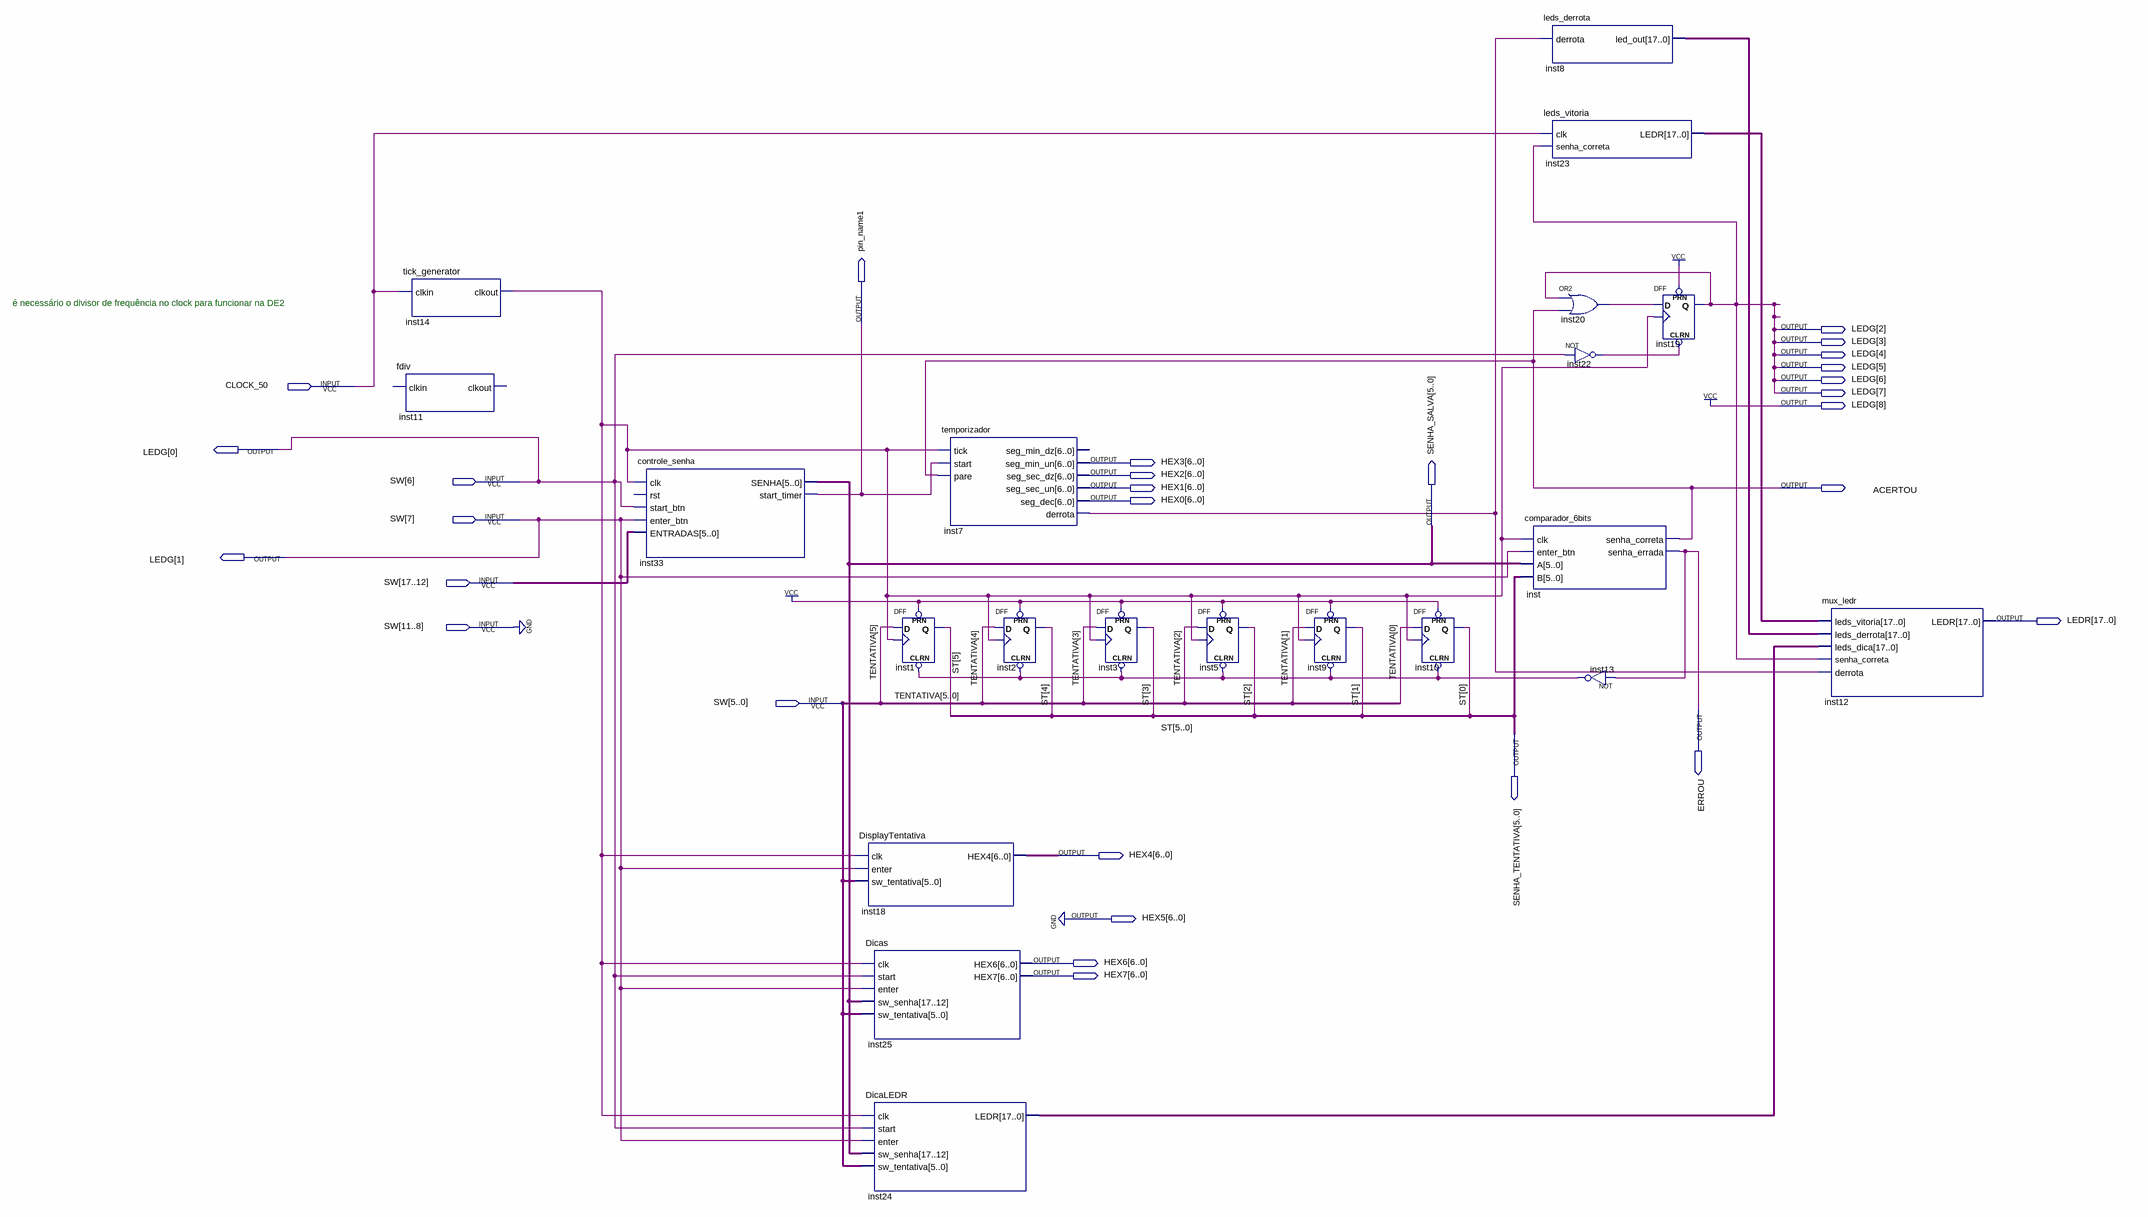
[diagram p0: schematic sheet]
// Quartus schematic bomba_relogio.bdf as structural Verilog: 21 symbols, 29 pins
module bomba_relogio (
  input  CLOCK_50,
  input  [17:0] SW,
  output pin_name1,
  output [8:0] LEDG,
  output [6:0] HEX3,
  output [6:0] HEX2,
  output [6:0] HEX1,
  output ACERTOU,
  output [6:0] HEX0,
  output [5:0] SENHA_SALVA,
  output [17:0] LEDR,
  output ERROU,
  output [5:0] SENHA_TENTATIVA,
  output [6:0] HEX4,
  output [6:0] HEX5,
  output [6:0] HEX6,
  output [6:0] HEX7
);

  wire inst7_derrota, inst13_out, inst14_clkout, inst20_out, inst22_out;
  wire [17:0] inst8_led_out, inst23_ledr, inst24_ledr;

  fdiv inst11 ();  // open: clkin, clkout
  tick_generator inst14 (.clkin(CLOCK_50), .clkout(inst14_clkout));
  controle_senha inst33 (
    .clk(inst14_clkout), .start_btn(SW[6]), .enter_btn(SW[7]), .ENTRADAS(SW[17:12]), .SENHA(SENHA_SALVA),
    .start_timer(pin_name1));  // open: rst
  DFF inst1 (.CLRN(inst13_out), .CLK(inst14_clkout), .D(SW[5]), .PRN(1'b1), .Q(SENHA_TENTATIVA[5]));
  DisplayTentativa inst18 (.clk(inst14_clkout), .enter(SW[7]), .sw_tentativa(SW[5:0]), .HEX4(HEX4));
  Dicas inst25 (
    .clk(inst14_clkout), .start(SW[6]), .enter(SW[7]), .sw_senha(SENHA_SALVA), .sw_tentativa(SW[5:0]),
    .HEX6(HEX6), .HEX7(HEX7));
  DicaLEDR inst24 (
    .clk(inst14_clkout), .start(SW[6]), .enter(SW[7]), .sw_senha(SENHA_SALVA), .sw_tentativa(SW[5:0]),
    .LEDR(inst24_ledr));
  temporizador inst7 (
    .tick(inst14_clkout), .start(pin_name1), .pare(ACERTOU), .seg_min_un(HEX3), .seg_sec_dz(HEX2),
    .seg_sec_un(HEX1), .seg_dec(HEX0), .derrota(inst7_derrota));  // open: seg_min_dz
  DFF inst2 (.CLRN(inst13_out), .CLK(inst14_clkout), .D(SW[4]), .PRN(1'b1), .Q(SENHA_TENTATIVA[4]));
  DFF inst3 (.CLRN(inst13_out), .CLK(inst14_clkout), .D(SW[3]), .PRN(1'b1), .Q(SENHA_TENTATIVA[3]));
  DFF inst5 (.CLRN(inst13_out), .CLK(inst14_clkout), .D(SW[2]), .PRN(1'b1), .Q(SENHA_TENTATIVA[2]));
  DFF inst9 (.CLRN(inst13_out), .CLK(inst14_clkout), .D(SW[1]), .PRN(1'b1), .Q(SENHA_TENTATIVA[1]));
  DFF inst10 (.CLRN(inst13_out), .CLK(inst14_clkout), .D(SW[0]), .PRN(1'b1), .Q(SENHA_TENTATIVA[0]));
  leds_derrota inst8 (.derrota(inst7_derrota), .led_out(inst8_led_out));
  leds_vitoria inst23 (.clk(CLOCK_50), .senha_correta(LEDG[7]), .LEDR(inst23_ledr));
  or inst20 (inst20_out, LEDG[7], ACERTOU);
  comparador_6bits inst (
    .clk(inst14_clkout), .enter_btn(SW[7]), .A(SENHA_SALVA), .B(SENHA_TENTATIVA), .senha_correta(ACERTOU),
    .senha_errada(ERROU));
  not inst22 (inst22_out, SW[6]);
  not inst13 (inst13_out, ERROU);
  DFF inst19 (.CLRN(inst22_out), .CLK(inst14_clkout), .D(inst20_out), .PRN(1'b1), .Q(LEDG[7]));
  mux_ledr inst12 (
    .leds_vitoria(inst23_ledr), .leds_derrota(inst8_led_out), .leds_dica(inst24_ledr),
    .senha_correta(LEDG[7]), .derrota(inst7_derrota), .LEDR(LEDR));

  assign HEX5 = {7{1'b0}};
  assign {LEDG[8], LEDG[6:0]} = {1'b1, {5{LEDG[7]}}, SW[7:6]};
  // also tied to GND on the sheet: {SW[8], SW[9], SW[10], SW[11]}

  // Other names for the same wires on the sheet: ST[5:0] = SENHA_TENTATIVA; TENTATIVA[5:0] = SW[5:0]

  // Notes on the sheet:
  //   é necessário o divisor de frequência no clock para funcionar na DE2
endmodule
